# EAGLE design ADC_Breakout (EAGLE 7.2.0)
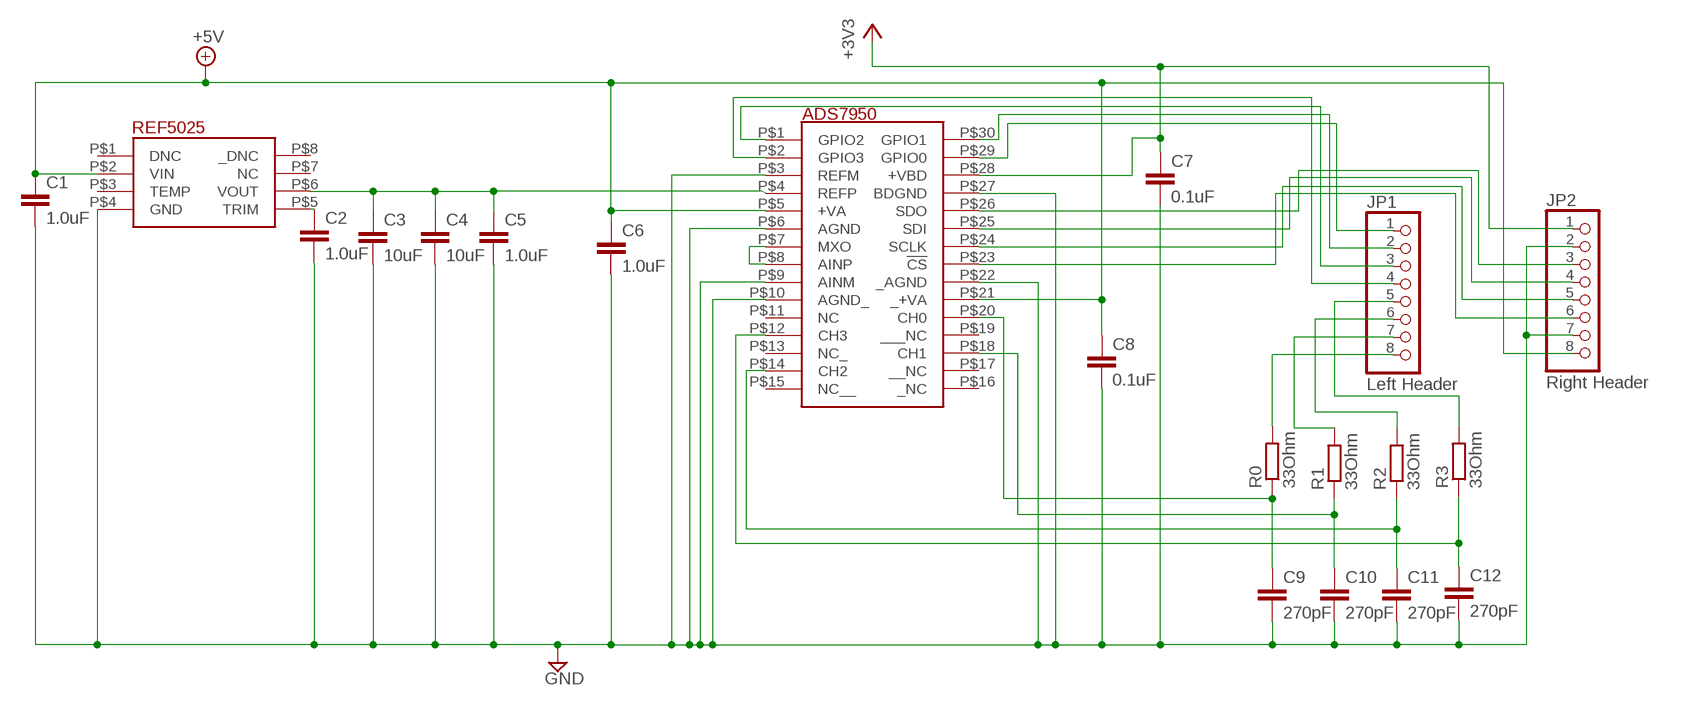
[diagram p0: schematic, sheet 1]

## Parts
ADS7950  ADS7950  [TSSOP-30]
C1  1.0uF  C-EUC0603  [C0603]
C2  1.0uF  C-EUC0603  [C0603]
C3  10uF  C-EUC0805  [C0805]
C4  10uF  C-EUC0805  [C0805]
C5  1.0uF  C-EUC0603  [C0603]
C6  1.0uF  C-EUC0603  [C0603]
C7  0.1uF  C-EUC0603  [C0603]
C8  0.1uF  C-EUC0603  [C0603]
C9  270pF  C-EUC0603  [C0603]
C10  270pF  C-EUC0603  [C0603]
C11  270pF  C-EUC0603  [C0603]
C12  270pF  C-EUC0603  [C0603]
JP1  Left Header  PINHD-1X8  [1X08]
JP2  Right Header  PINHD-1X8  [1X08]
R0  33Ohm  R-EU_R1206  [R1206]
R1  33Ohm  R-EU_R1206  [R1206]
R2  33Ohm  R-EU_R1206  [R1206]
R3  33Ohm  R-EU_R1206  [R1206]
REF5025  REF5025  [SOIC-8]

## Nets
+3V3: ADS7950.P$28(+VBD) C7.1 JP2.1
+5V: ADS7950.P$5(+VA) ADS7950.P$21(_+VA) C1.1 C6.1 C8.1 JP2.8 REF5025.P$2(VIN)
GND: ADS7950.P$3(REFM) ADS7950.P$6(AGND) ADS7950.P$9(AINM) ADS7950.P$10(AGND_) ADS7950.P$22(_AGND) ADS7950.P$27(BDGND) C1.2 C2.2 C3.2 C4.2 C5.2 C6.2 C7.2 C8.2 C9.2 C10.2 C11.2 C12.2 JP2.2 JP2.7 REF5025.P$4(GND)
N$1: C2.1 REF5025.P$5(TRIM)
N$3: ADS7950.P$29(GPIO0) JP1.1
N$4: ADS7950.P$7(MXO) ADS7950.P$8(AINP)
N$5: ADS7950.P$30(GPIO1) JP1.2
N$6: ADS7950.P$1(GPIO2) JP1.3
N$7: ADS7950.P$2(GPIO3) JP1.4
N$9: JP1.7 R1.2
N$10: JP1.6 R2.2
N$11: JP1.5 R3.2
N$13: ADS7950.P$18(CH1) C10.1 R1.1
N$14: ADS7950.P$14(CH2) C11.1 R2.1
N$15: JP1.8 R0.2
N$16: ADS7950.P$23(!CS!) JP2.6
N$17: ADS7950.P$12(CH3) C12.1 R3.1
N$18: ADS7950.P$26(SDO) JP2.3
N$19: ADS7950.P$25(SDI) JP2.4
N$20: ADS7950.P$24(SCLK) JP2.5
N$21: ADS7950.P$20(CH0) C9.1 R0.1
REFP: ADS7950.P$4(REFP) C3.1 C4.1 C5.1 REF5025.P$6(VOUT)
Unconnected: ADS7950.P$11(NC) ADS7950.P$13(NC_) ADS7950.P$15(NC__) ADS7950.P$16(_NC) ADS7950.P$17(__NC) ADS7950.P$19(___NC) REF5025.P$1(DNC) REF5025.P$3(TEMP) REF5025.P$7(NC) REF5025.P$8(_DNC)

## Library data of the parts
ADS7950 = Ian:ADS7950
C1-C12 = rcl:C-EU: CAPACITOR, European symbol
JP1 JP2 = Ian_Header:PINHD-1X8: PIN HEADER
R0 R1-R3 = rcl:R-EU_: RESISTOR, European symbol
REF5025 = Ian:REF5025

## Board
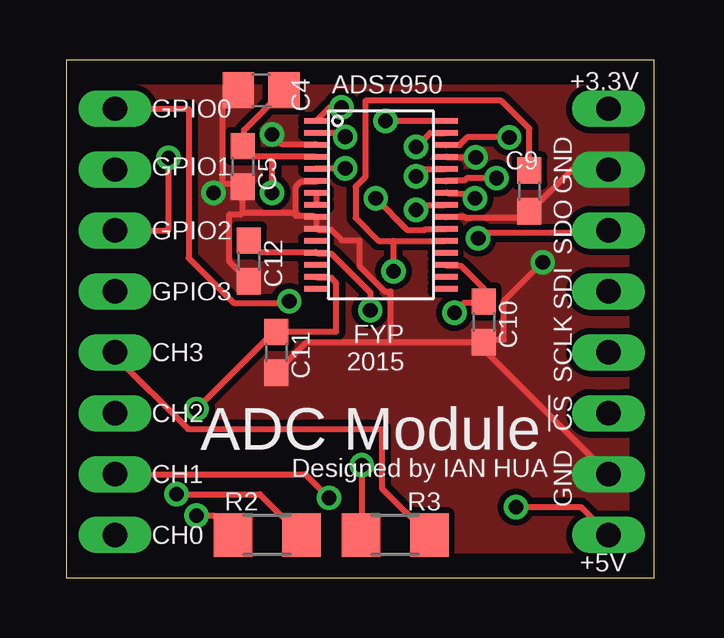
[diagram p1: board, top side]
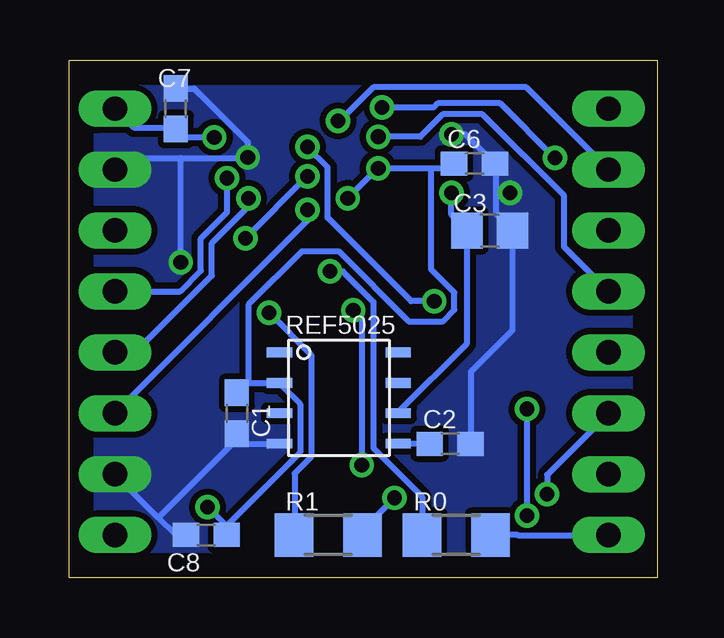
[diagram p2: board, bottom side, seen from below]

Size 24.51 x 21.59 mm. Coordinates in mm from the lower left corner, seen from the top.
Outline: 0,0 24.51,0 24.51,21.59 0,21.59 0,0
Copper layers (1*16): Top 0.035mm / dielectric 1.5mm / Bottom 0.035mm
Design rules "default": minimum track width 10mil, minimum drill 24mil, track to track 8mil, track to pad 8mil, pad to pad 8mil, via to via 8mil, smd to smd 8mil, copper to edge 40mil, drill to drill 8mil, minimum pad ring 10mil, minimum via ring 8mil, stop-mask expansion 4mil, vias tented up to drill 0mil, thermal gap 10mil

### Footprints (pad centres in the part's own frame; a part is rotated, then mirrored left to right if it is on the bottom)
TSSOP-30 = smd 0.22 x 1: P$1 0,0; P$2 0.5,0; P$3 1,0; P$4 1.5,0; P$5 2,0; P$6 2.5,0; P$7 3,0; P$8 3.5,0; P$9 4,0; P$10 4.5,0; P$11 5,0; P$12 5.5,0; P$13 6,0; P$14 6.5,0; P$15 7,0; P$16 7,5.4; P$17 6.5,5.4; P$18 6,5.4; P$19 5.5,5.4; P$20 5,5.4; P$21 4.5,5.4; P$22 4,5.4; P$23 3.5,5.4; P$24 3,5.4; P$25 2.5,5.4; P$26 2,5.4; P$27 1.5,5.4; P$28 1,5.4; P$29 0.5,5.4; P$30 0,5.4
C0603 = smd 1.1 x 1: 1 -0.85,0; 2 0.85,0
C0805 = smd 1.3 x 1.5: 1 -0.95,0; 2 0.95,0
1X08 = drill 1.016 long: 1 -8.89,0; 2 -6.35,0; 3 -3.81,0; 4 -1.27,0; 5 1.27,0; 6 3.81,0; 7 6.35,0; 8 8.89,0
R1206 = smd 1.6 x 1.803: 1 -1.422,0; 2 1.422,0
SOIC-8 = smd 0.41 x 1.05: P$1 0,0; P$2 1.27,0; P$3 2.54,0; P$4 3.81,0; P$5 3.81,4.95; P$6 2.54,4.95; P$7 1.27,4.95; P$8 0,4.95

### Placement (x,y rotation side)
ADS7950  10.41,19.05 270 top
C1  17.53,6.86 270 bottom
C2  8.64,5.59 0 bottom
C3  6.99,14.48 0 bottom
C4  8.13,20.32 180 top
C5  7.37,17.14 270 top
C6  7.62,17.27 0 bottom
C7  20.07,19.56 90 bottom
C8  18.8,1.78 180 bottom
C9  19.3,16.13 270 top
C10  17.4,10.67 270 top
C11  8.76,9.4 270 top
C12  7.62,13.21 270 top
JP1  2.03,10.67 270 top
JP2  22.61,10.67 270 top
R0  8.38,1.78 0 bottom
R1  13.72,1.78 0 bottom
R2  8.38,1.78 0 top
R3  13.72,1.78 0 top
REF5025  15.75,9.4 270 bottom

### Tracks (layer width: path | path; a pad name or v marks a point on that pad's centre or on a via)
+3V3  (via drill 0.61)
  Top 0.254: v18.47,18.36 16.71,18.36 16.38,18.03 15.82,18.03 ADS7950.P$28
  Bottom 0.254: v18.47,18.36 19.74,18.36 20.07,18.69 C7.1 20.17,18.77 21.82,18.77 JP2.1
+5V  (via drill 0.61)
  Top 0.254: v11.63,17.07 10.41,17.07 ADS7950.P$5 | v12.9,15.82 14.22,14.5 14.94,14.5 14.96,14.53 15.8,14.53 ADS7950.P$21 | JP2.8 21.44,2.95 v18.75,2.95
  Bottom 0.254: 9.42,17.07 8.69,17.07 8.48,17.27 C6.1 | 9.42,17.07 v11.63,17.07 11.73,16.99 v12.9,15.82 | 17.02,8.13 17.12,8.13 17.53,7.72 C1.1 | 17.02,8.13 REF5025.P$2 15.67,8.03 14.88,7.24 14.88,5.23 17.93,2.18 17.93,1.78 C8.1 18.03,2.23 v18.75,2.95 | 9.42,17.07 9.42,12.85 8.46,11.89 8.46,11.18 8.94,10.69 10.36,10.69 13.28,13.61 14.81,13.61 17.02,11.4 17.02,8.13
GND  (via drill 0.61)
  Top 0.254: v8.59,18.49 8.99,18.09 10.39,18.09 ADS7950.P$3 | v17.07,17.53 15.9,17.53 15.88,17.55 15.82,17.55 ADS7950.P$27 | ADS7950.P$22 15.82,15.04 16.64,15.04 16.69,14.99 19.02,14.99 19.3,15.27 C9.2 19.41,15.34 21.08,17.02 JP2.2 | 13.51,9.8 17.4,9.8 C10.2 | 13.51,9.8 10.01,9.8 C11.2 | 9.58,15.21 9.58,15.09 10.31,15.09 ADS7950.P$9 ADS7950.P$10 10.52,14.5 11.05,14.5 11.48,14.07 12.22,14.07 12.22,13.01 13.28,11.94 13.51,11.94 13.51,9.8 | 9.58,15.21 9.58,16.31 9.78,16.51 10.39,16.51 10.41,16.54 ADS7950.P$6 | 7.37,15.21 C5.2 7.32,16.41 6.53,16.41 | 9.58,15.21 7.37,15.21 | C12.2 6.78,13.21 6.78,15.14 7.26,15.14 7.37,15.21 | 6.53,16.41 6.53,19.68 7.16,20.32 C4.2 | JP2.7 17.22,9.7 C10.2 | v19.86,13.16 18.24,11.53 18.24,9.93 17.48,9.93 C10.2 | v6.15,16.05 6.43,16.33 6.53,16.41
  Bottom 0.254: v8.59,18.49 8,18.49 6.78,17.27 C6.2 6.71,17.17 6.71,16.05 | C2.2 7.77,5.59 7.77,8.59 6.04,10.31 C3.2 6.12,14.58 6.71,15.16 6.71,16.05 | C7.2 20.07,20.4 19.3,20.4 17.07,18.16 v17.07,17.53 17.17,17.5 19.86,17.5 | 19.86,17.5 22.12,17.5 JP2.2 | REF5025.P$4 17.12,5.59 17.53,5.99 C1.2 17.5,5.79 20.79,2.5 | C8.2 20.07,1.78 20.79,2.5 | JP2.7 20.79,2.5 | v19.86,13.16 19.86,17.5 | v6.15,16.05 6.71,16.05
  pour Bottom (isolate 0.254, no thermals): 0,0 0,21.59 24.51,21.59 24.51,21.46 24.51,0
  pour Top (isolate 0.254, no thermals): 0,0 0,21.59 24.51,21.59 24.51,21.08 24.51,0
N$1
  Bottom 0.254: C2.1 REF5025.P$5
N$3  (via drill 0.61)
  Top 0.254: v14.58,17.96 15.16,18.54 15.8,18.54 ADS7950.P$29 | v9.3,11.53 9.22,11.46 6.99,11.46 5.11,13.34 5.11,19.56 JP1.1
  Bottom 0.254: v14.58,17.96 13.74,17.12 13.74,15.01 10.26,11.53 v9.3,11.53
N$4
  Top 0.254: ADS7950.P$7 ADS7950.P$8
N$5  (via drill 0.61)
  Top 0.254: v13.31,19.05 ADS7950.P$30
  Bottom 0.254: v13.31,19.05 13.23,19.05 11.84,20.45 5.46,20.45 JP1.2
N$6  (via drill 0.61)
  Top 0.254: ADS7950.P$1 10.97,19.61 v11.48,19.61 | v4.27,17.5 4.27,14.48 JP1.3
  Bottom 0.254: v11.48,19.61 9.32,19.61 9.14,19.79 6.55,19.79 v4.27,17.5
N$7  (via drill 0.61)
  Top 0.254: v11.63,18.39 11.48,18.54 ADS7950.P$2
  Bottom 0.254: v11.63,18.39 9.88,18.39 8.94,19.33 7.29,19.33 3.89,15.93 3.89,13.79 JP1.4
N$9  (via drill 0.61)
  Top 0.254: v10.95,3.33 9.96,4.32 JP1.7
  Bottom 0.254: R1.2 12.29,1.98 v10.95,3.33 | R1.2
N$10  (via drill 0.61)
  Top 0.254: v4.6,3.48 8.08,3.48 9.78,1.78 R2.2
  Bottom 0.254: v4.6,3.48 4.6,4.29 JP1.6
N$11
  Top 0.254: JP1.5 2.03,9.25 5.08,6.2 13.16,6.2 13.16,3.73 15.11,1.78 R3.2
N$13  (via drill 0.61)
  Top 0.254: ADS7950.P$18 15.82,13.03 15.85,13.01 16.46,13.01 17.4,12.06 C10.1 17.3,11.46 16.59,11.46 v16.18,11.05
  Bottom 0.254: v16.18,11.05 14.43,9.3 14.43,5.03 15.11,4.34 15.11,1.78 R1.1
N$14  (via drill 0.61)
  Top 0.254: ADS7950.P$14 10.46,12.5 11.05,12.5 11.25,12.29 11.25,10.26 8.76,10.26 C11.1 8.66,10.19 8.59,10.19 v5.44,7.04 | R2.1 6.15,2.59 v5.44,2.59 | R2.1
  Bottom 0.254: v5.44,7.04 v5.44,2.59
N$15
  Bottom 0.254: R0.2 5.82,1.78 5.79,1.75 2.06,1.75 JP1.8
N$16  (via drill 0.61)
  Top 0.254: v14.58,15.34 14.78,15.54 15.8,15.54 ADS7950.P$23
  Bottom 0.254: v14.58,15.34 14.58,14.88 JP2.6
N$17  (via drill 0.61)
  Top 0.254: C12.1 7.62,14.05 8.08,13.59 10.39,13.59 10.41,13.56 ADS7950.P$12 10.52,13.51 11.05,13.51 12.68,11.89 v12.68,11.15 | v12.32,4.7 12.32,1.78 R3.1
  Bottom 0.254: v12.32,4.7 12.32,10.79 v12.68,11.15
N$18  (via drill 0.61)
  Top 0.254: v14.58,16.74 14.88,17.04 15.8,17.04 ADS7950.P$26 | v17.17,14.15 17.4,14.38 22.5,14.38 JP2.3
  Bottom 0.254: v17.17,14.15 v14.58,16.74
N$19  (via drill 0.61)
  Top 0.254: v17.93,16.66 16.69,16.66 16.59,16.56 15.85,16.56 15.82,16.54 ADS7950.P$25
  Bottom 0.254: v17.93,16.66 17.93,15.24 19.02,14.15 19.02,12.8 19.89,11.94 JP2.4
N$20  (via drill 0.61)
  Top 0.254: v17.04,15.82 16.87,16 15.95,16 15.9,16.05 15.82,16.05 ADS7950.P$24
  Bottom 0.254: v17.04,15.82 17.04,15.47 18.57,13.95 18.57,12.6 21.77,9.4 JP2.5
N$21  (via drill 0.61)
  Top 0.254: 13.64,14.05 13.03,14.05 12.06,15.01 12.06,16.31 12.47,16.71 12.47,19.89 18.14,19.89 19.3,18.72 C9.1 | 13.64,14.05 15.8,14.05 ADS7950.P$20 | 13.64,14.05 v13.64,12.78
  Bottom 0.254: R0.1 9.8,3.38 11.84,5.41 11.84,11.51 13.11,12.78 v13.64,12.78 | R0.1
REFP  (via drill 0.61)
  Top 0.254: 8.59,17.58 7.77,17.58 7.37,17.98 C5.1 7.42,18.11 7.42,18.67 9.07,20.32 C4.1 | 8.59,17.58 10.39,17.58 ADS7950.P$4 | v8.59,16.05 8.59,17.58
  Bottom 0.254: REF5025.P$6 10.79,6.91 7.95,9.75 C3.1 8.03,14.58 8.59,15.14 v8.59,16.05

### Text on the board
tPlace: +3.3V | GPIO0 | GPIO1 | GND | GPIO2 | SDO | GPIO3 | FYP / 2015 | SDI | CH3 | SCLK | CH2 | !CS! | ADC Module | GND | CH1 | Designed by IAN HUA | CH0 | +5V